# EAGLE design rhex (EAGLE 7.5.0)
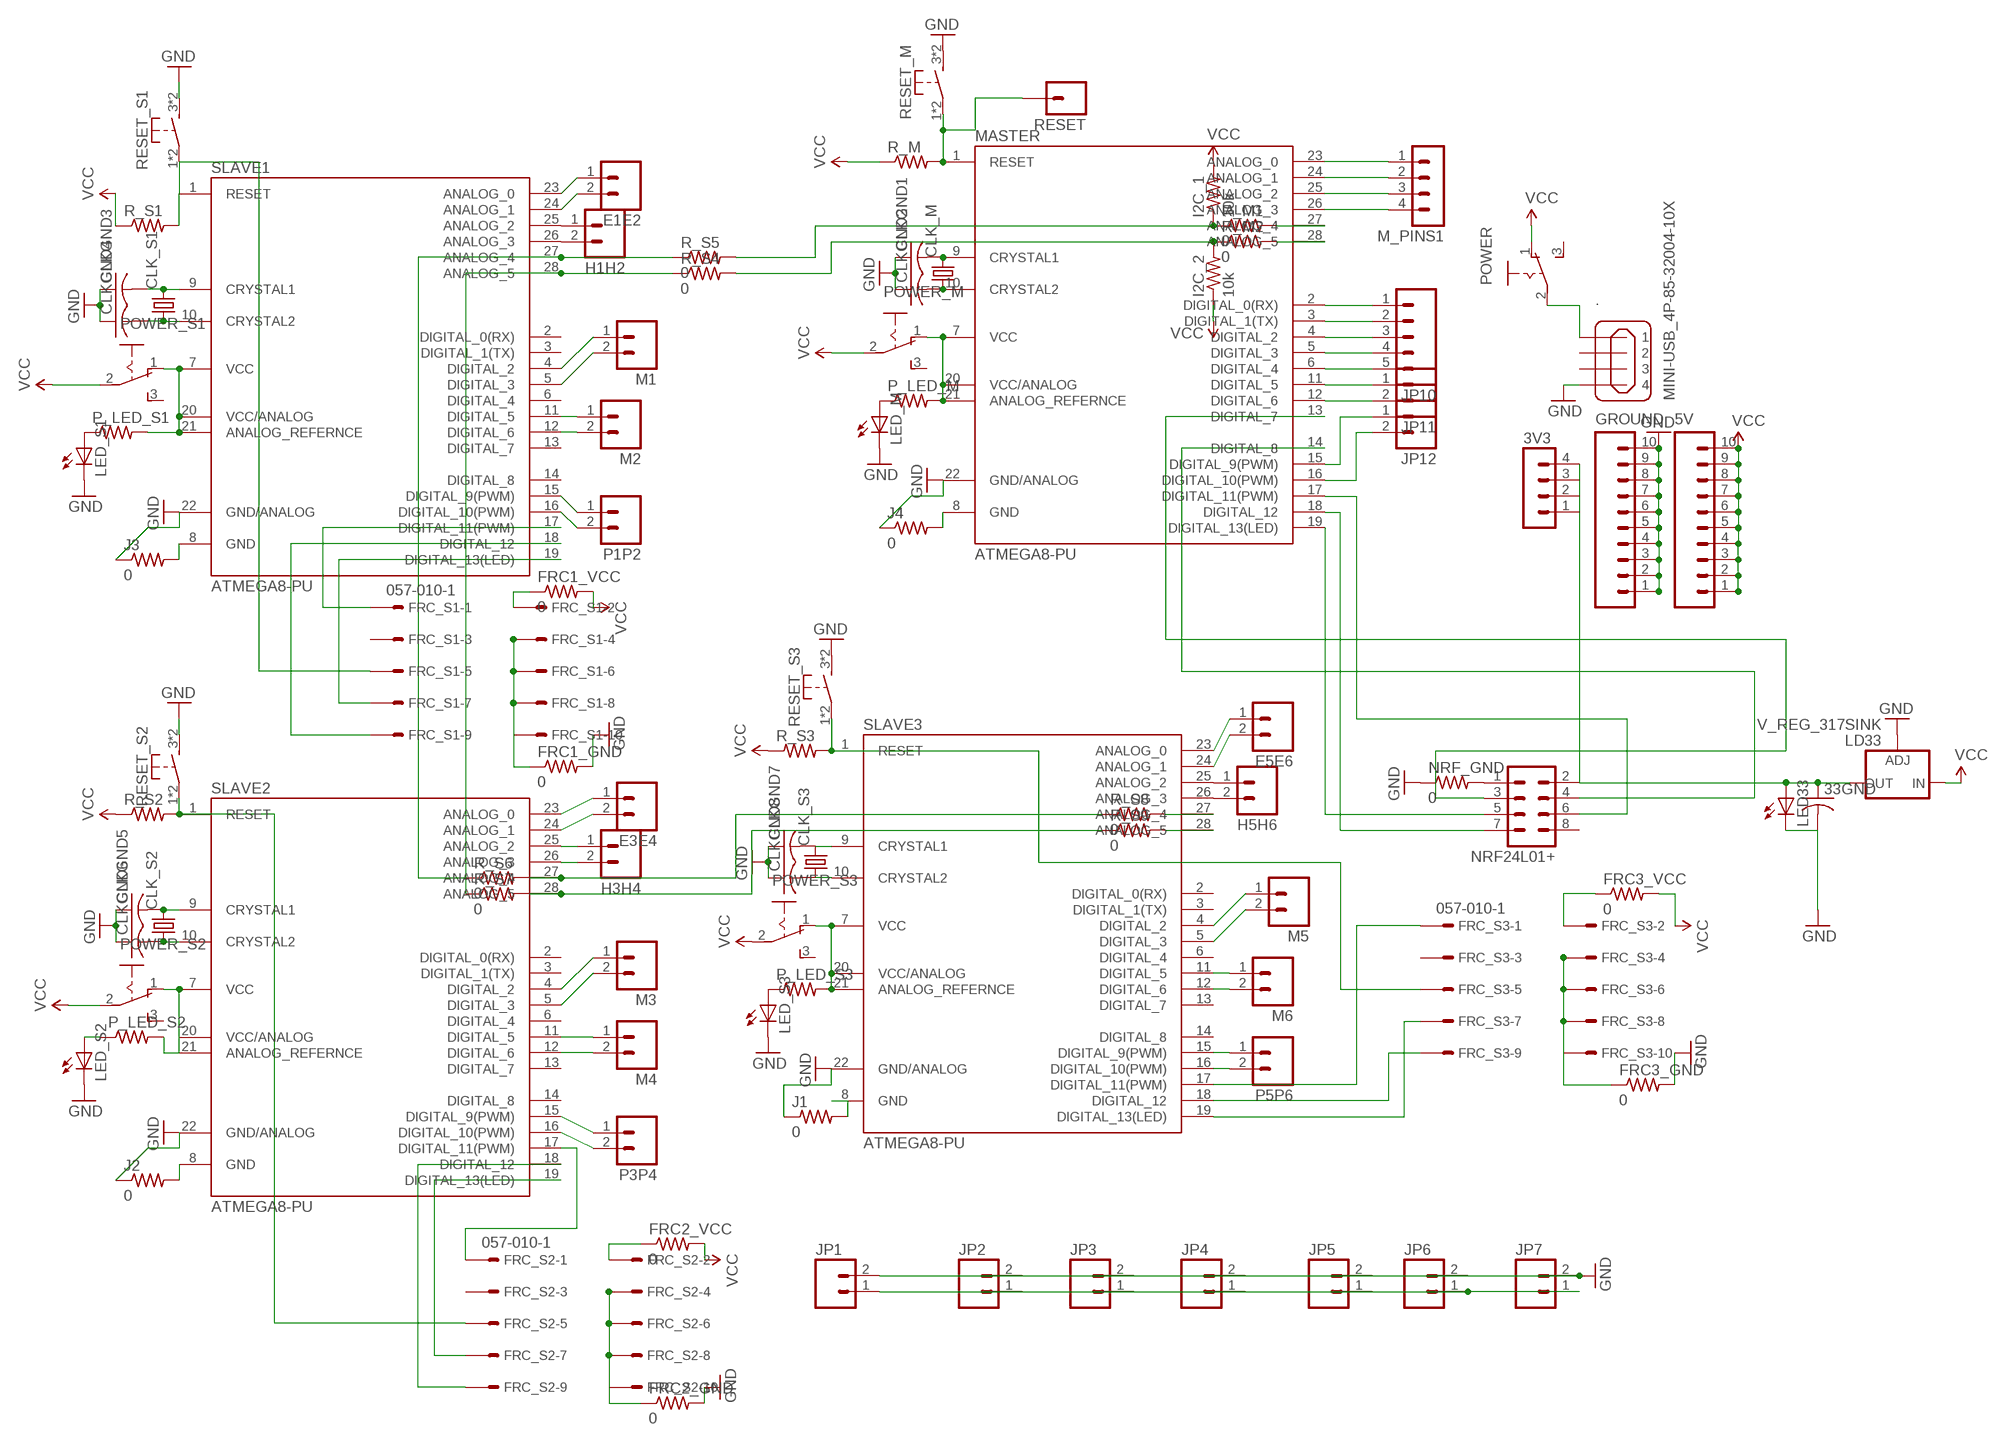
[diagram p0: schematic, sheet 1]

## Parts
3V3  MA04-1  [MA04-1]
5V  M10SILK_FEMALE_PTH  [1X10]
33GND  C-US050-024X044  [C050-024X044]
.  MINI-USB_4P-85-32004-10X  [85-32004-10X]
CLK_M  CRYSTALHC49U-V  [HC49U-V]
CLK_S1  CRYSTALHC49U-V  [HC49U-V]
CLK_S2  CRYSTALHC49U-V  [HC49U-V]
CLK_S3  CRYSTALHC49U-V  [HC49U-V]
CLKGND1  C-US050-024X044  [C050-024X044]
CLKGND2  C-US050-024X044  [C050-024X044]
CLKGND3  C-US050-024X044  [C050-024X044]
CLKGND4  C-US050-024X044  [C050-024X044]
CLKGND5  C-US050-024X044  [C050-024X044]
CLKGND6  C-US050-024X044  [C050-024X044]
CLKGND7  C-US050-024X044  [C050-024X044]
CLKGND8  C-US050-024X044  [C050-024X044]
E1E2  M02LOCK  [1X02_LOCK]
E3E4  M02LOCK  [1X02_LOCK]
E5E6  M02LOCK  [1X02_LOCK]
FRC1_GND  0  R-US_0411/15  [0411/15]
FRC1_VCC  0  R-US_0411/15  [0411/15]
FRC2_GND  0  R-US_0411/15  [0411/15]
FRC2_VCC  0  R-US_0411/15  [0411/15]
FRC3_GND  0  R-US_0411/15  [0411/15]
FRC3_VCC  0  R-US_0411/15  [0411/15]
FRC_S1  057-010-1  [057-010-1]
FRC_S2  057-010-1  [057-010-1]
FRC_S3  057-010-1  [057-010-1]
GROUND  M10SILK_FEMALE_PTH  [1X10]
H1H2  M02LOCK  [1X02_LOCK]
H3H4  M02LOCK  [1X02_LOCK]
H5H6  M02LOCK  [1X02_LOCK]
I2C_1  10k  R-US_0411/15  [0411/15]
I2C_2  10k  R-US_0411/15  [0411/15]
J1  0  R-US_0411/15  [0411/15]
J2  0  R-US_0411/15  [0411/15]
J3  0  R-US_0411/15  [0411/15]
J4  0  R-US_0411/15  [0411/15]
JP1  M023.5MM  [SCREWTERMINAL-3.5MM-2]
JP2  M023.5MM  [SCREWTERMINAL-3.5MM-2]
JP3  M023.5MM  [SCREWTERMINAL-3.5MM-2]
JP4  M023.5MM  [SCREWTERMINAL-3.5MM-2]
JP5  M023.5MM  [SCREWTERMINAL-3.5MM-2]
JP6  M023.5MM  [SCREWTERMINAL-3.5MM-2]
JP7  M023.5MM  [SCREWTERMINAL-3.5MM-2]
JP10  M05PTH  [1X05]
JP11  M02PTH  [1X02]
JP12  M02PTH  [1X02]
LD33  V_REG_317SINK  [TO220-ADJ]
LED33  LED3MM  [LED3MM]
LED_M  LED3MM  [LED3MM]
LED_S1  LED3MM  [LED3MM]
LED_S2  LED3MM  [LED3MM]
LED_S3  LED3MM  [LED3MM]
M1  M02LOCK  [1X02_LOCK]
M2  M02LOCK  [1X02_LOCK]
M3  M02LOCK  [1X02_LOCK]
M4  M02LOCK  [1X02_LOCK]
M5  M02LOCK  [1X02_LOCK]
M6  M02LOCK  [1X02_LOCK]
M_PINS1  MA04-1  [MA04-1]
MASTER  ATMEGA8-PU  [DIL28-3]
NRF24L01+  MA04-2  [MA04-2]
NRF_GND  0  R-US_0411/15  [0411/15]
P1P2  M02LOCK  [1X02_LOCK]
P3P4  M02LOCK  [1X02_LOCK]
P5P6  M02LOCK  [1X02_LOCK]
P_LED_M  R-US_0411/15  [0411/15]
P_LED_S1  R-US_0411/15  [0411/15]
P_LED_S2  R-US_0411/15  [0411/15]
P_LED_S3  R-US_0411/15  [0411/15]
POWER  M251  [M251]
POWER_M  M251  [M251]
POWER_S1  M251  [M251]
POWER_S2  M251  [M251]
POWER_S3  M251  [M251]
R_M  R-US_0411/15  [0411/15]
R_M1  0  R-US_0411/15  [0411/15]
R_M2  0  R-US_0411/15  [0411/15]
R_S1  R-US_0411/15  [0411/15]
R_S2  R-US_0411/15  [0411/15]
R_S3  R-US_0411/15  [0411/15]
R_S4  0  R-US_0411/15  [0411/15]
R_S5  0  R-US_0411/15  [0411/15]
R_S6  0  R-US_0411/15  [0411/15]
R_S7  0  R-US_0411/15  [0411/15]
R_S8  0  R-US_0411/15  [0411/15]
R_S9  0  R-US_0411/15  [0411/15]
RESET  M01PTH  [1X01]
RESET_M  SW-TACTILE-6X6  [SW6X6]
RESET_S1  SW-TACTILE-6X6  [SW6X6]
RESET_S2  SW-TACTILE-6X6  [SW6X6]
RESET_S3  SW-TACTILE-6X6  [SW6X6]
SLAVE1  ATMEGA8-PU  [DIL28-3]
SLAVE2  ATMEGA8-PU  [DIL28-3]
SLAVE3  ATMEGA8-PU  [DIL28-3]

## Nets
3V3: 3V3.1 3V3.4 33GND.1 LD33.OUT LED33.A NRF24L01+.2
12V: JP1.1 JP2.1 JP3.1 JP4.1 JP5.1 JP6.1 JP7.1
GND: 33GND.2 ..4 CLKGND1.1 CLKGND2.1 CLKGND3.1 CLKGND4.1 CLKGND5.1 CLKGND6.1 CLKGND7.1 CLKGND8.1 FRC1_GND.2 FRC2_GND.2 FRC3_GND.2 GROUND.1 GROUND.2 GROUND.3 GROUND.4 GROUND.5 GROUND.6 GROUND.7 GROUND.8 GROUND.9 GROUND.10 J1.1 J2.1 J3.1 J4.1 JP1.2 JP2.2 JP3.2 JP4.2 JP5.2 JP6.2 JP7.2 LD33.ADJ LED33.K(C) LED_M.K(C) LED_S1.K(C) LED_S2.K(C) LED_S3.K(C) MASTER.22(GND/ANALOG) NRF_GND.1 RESET_M.3(S1) RESET_M.4(S1) RESET_S1.3(S1) RESET_S1.4(S1) RESET_S2.3(S1) RESET_S2.4(S1) RESET_S3.3(S1) RESET_S3.4(S1) SLAVE1.22(GND/ANALOG) SLAVE2.22(GND/ANALOG) SLAVE3.22(GND/ANALOG)
N$1: CLK_M.2 CLKGND1.2 MASTER.9(CRYSTAL1)
N$2: CLK_M.1 CLKGND2.2 MASTER.10(CRYSTAL2)
N$3: MASTER.1(RESET) R_M.2 RESET.1 RESET_M.1 RESET_M.2(P1)
N$4: FRC_S2.1 SLAVE2.17(DIGITAL_11(PWM))
N$5: FRC_S3.5 R_S3.2 RESET_S3.1 RESET_S3.2(P1) SLAVE3.1(RESET)
N$6: FRC_S2.5 R_S2.2 RESET_S2.1 RESET_S2.2(P1) SLAVE2.1(RESET)
N$7: M3.1 SLAVE2.4(DIGITAL_2)
N$8: MASTER.19(DIGITAL_13(LED)) NRF24L01+.5
N$9: MASTER.18(DIGITAL_12) NRF24L01+.7
N$10: MASTER.17(DIGITAL_11(PWM)) NRF24L01+.6
N$11: R_S5.1 R_S6.1 SLAVE1.27(ANALOG_4)
N$12: R_S4.1 R_S7.1 SLAVE1.28(ANALOG_5)
N$13: M1.1 SLAVE1.4(DIGITAL_2)
N$14: M1.2 SLAVE1.5(DIGITAL_3)
N$15: M3.2 SLAVE2.5(DIGITAL_3)
N$16: M5.1 SLAVE3.4(DIGITAL_2)
N$17: M2.1 SLAVE1.11(DIGITAL_5)
N$18: MASTER.13(DIGITAL_7) NRF24L01+.3
N$19: M5.2 SLAVE3.5(DIGITAL_3)
N$20: M4.1 SLAVE2.11(DIGITAL_5)
N$21: M4.2 SLAVE2.12(DIGITAL_6)
N$22: M6.1 SLAVE3.11(DIGITAL_5)
N$23: M6.2 SLAVE3.12(DIGITAL_6)
N$24: M2.2 SLAVE1.12(DIGITAL_6)
N$25: JP10.1 MASTER.2(DIGITAL_0(RX))
N$26: I2C_2.2 R_M2.1 R_S4.2
N$27: NRF24L01+.1 NRF_GND.2
N$28: FRC_S2.7 SLAVE2.19(DIGITAL_13(LED))
N$29: E1E2.1 SLAVE1.23(ANALOG_0)
N$30: E1E2.2 SLAVE1.24(ANALOG_1)
N$31: E3E4.1 SLAVE2.23(ANALOG_0)
N$32: E3E4.2 SLAVE2.24(ANALOG_1)
N$33: E5E6.1 SLAVE3.23(ANALOG_0)
N$34: E5E6.2 SLAVE3.24(ANALOG_1)
N$35: CLK_S1.2 CLKGND3.2 SLAVE1.9(CRYSTAL1)
N$36: CLK_S1.1 CLKGND4.2 SLAVE1.10(CRYSTAL2)
N$37: CLK_S2.2 CLKGND5.2 SLAVE2.9(CRYSTAL1)
N$38: P3P4.1 SLAVE2.15(DIGITAL_9(PWM))
N$39: P3P4.2 SLAVE2.16(DIGITAL_10(PWM))
N$40: CLK_S2.1 CLKGND6.2 SLAVE2.10(CRYSTAL2)
N$41: CLK_S3.2 CLKGND7.2 SLAVE3.9(CRYSTAL1)
N$42: CLK_S3.1 CLKGND8.2 SLAVE3.10(CRYSTAL2)
N$43: FRC_S2.9 SLAVE2.18(DIGITAL_12)
N$44: ..1 POWER.2(P)
N$45: FRC_S3.1 SLAVE3.17(DIGITAL_11(PWM))
N$46: P_LED_S1.2 POWER_S1.1(O) SLAVE1.7(VCC) SLAVE1.20(VCC/ANALOG) SLAVE1.21(ANALOG_REFERNCE)
N$47: FRC_S3.7 SLAVE3.19(DIGITAL_13(LED))
N$48: FRC_S3.9 SLAVE3.18(DIGITAL_12)
N$49: FRC_S1.7 SLAVE1.19(DIGITAL_13(LED))
N$50: FRC_S1.9 SLAVE1.18(DIGITAL_12)
N$51: FRC_S1.1 SLAVE1.17(DIGITAL_11(PWM))
N$52: P1P2.1 SLAVE1.15(DIGITAL_9(PWM))
N$53: P_LED_S2.2 POWER_S2.1(O) SLAVE2.7(VCC) SLAVE2.20(VCC/ANALOG) SLAVE2.21(ANALOG_REFERNCE)
N$54: MASTER.7(VCC) MASTER.20(VCC/ANALOG) MASTER.21(ANALOG_REFERNCE) P_LED_M.2 POWER_M.1(O)
N$55: P_LED_S3.2 POWER_S3.1(O) SLAVE3.7(VCC) SLAVE3.20(VCC/ANALOG) SLAVE3.21(ANALOG_REFERNCE)
N$56: P1P2.2 SLAVE1.16(DIGITAL_10(PWM))
N$57: P5P6.1 SLAVE3.15(DIGITAL_9(PWM))
N$58: P5P6.2 SLAVE3.16(DIGITAL_10(PWM))
N$59: H5H6.1 SLAVE3.25(ANALOG_2)
N$60: H5H6.2 SLAVE3.26(ANALOG_3)
N$61: H1H2.1 SLAVE1.25(ANALOG_2)
N$62: H1H2.2 SLAVE1.26(ANALOG_3)
N$63: H3H4.1 SLAVE2.25(ANALOG_2)
N$64: H3H4.2 SLAVE2.26(ANALOG_3)
N$65: LED_S1.A P_LED_S1.1
N$66: LED_M.A P_LED_M.1
N$67: LED_S3.A P_LED_S3.1
N$68: FRC2_GND.1 FRC_S2.4 FRC_S2.6 FRC_S2.8 FRC_S2.10
N$69: LED_S2.A P_LED_S2.1
N$70: JP10.2 MASTER.3(DIGITAL_1(TX))
N$71: JP10.3 MASTER.4(DIGITAL_2)
N$72: JP10.4 MASTER.5(DIGITAL_3)
N$73: JP10.5 MASTER.6(DIGITAL_4)
N$74: JP11.1 MASTER.11(DIGITAL_5)
N$75: JP11.2 MASTER.12(DIGITAL_6)
N$76: JP12.1 MASTER.15(DIGITAL_9(PWM))
N$77: JP12.2 MASTER.16(DIGITAL_10(PWM))
N$78: MASTER.14(DIGITAL_8) NRF24L01+.4
N$79: M_PINS1.1 MASTER.23(ANALOG_0)
N$80: M_PINS1.2 MASTER.24(ANALOG_1)
N$81: M_PINS1.3 MASTER.25(ANALOG_2)
N$82: M_PINS1.4 MASTER.26(ANALOG_3)
N$83: J1.2 SLAVE3.8(GND)
N$84: J2.2 SLAVE2.8(GND)
N$85: J3.2 SLAVE1.8(GND)
N$86: J4.2 MASTER.8(GND)
N$87: FRC1_GND.1 FRC_S1.4 FRC_S1.6 FRC_S1.8 FRC_S1.10
N$88: FRC_S1.5 R_S1.2 RESET_S1.1 RESET_S1.2(P1) SLAVE1.1(RESET)
N$89: FRC3_GND.1 FRC_S3.4 FRC_S3.6 FRC_S3.8 FRC_S3.10
N$90: FRC1_VCC.1 FRC_S1.2
N$91: FRC2_VCC.1 FRC_S2.2
N$92: FRC3_VCC.1 FRC_S3.2
N$93: I2C_1.1 R_M1.1 R_S5.2
N$94: R_S6.2 R_S8.1 SLAVE2.27(ANALOG_4)
N$95: R_S7.2 R_S9.1 SLAVE2.28(ANALOG_5)
N$96: R_S8.2 SLAVE3.27(ANALOG_4)
N$97: R_S9.2 SLAVE3.28(ANALOG_5)
N$98: MASTER.27(ANALOG_4) R_M1.2
N$99: MASTER.28(ANALOG_5) R_M2.2
VCC: 5V.1 5V.2 5V.3 5V.4 5V.5 5V.6 5V.7 5V.8 5V.9 5V.10 FRC1_VCC.2 FRC2_VCC.2 FRC3_VCC.2 I2C_1.2 I2C_2.1 LD33.IN POWER.1(O) POWER_M.2(P) POWER_S1.2(P) POWER_S2.2(P) POWER_S3.2(P) R_M.1 R_S1.1 R_S2.1 R_S3.1
Unconnected: 3V3.2 3V3.3 ..2 ..3 FRC_S1.3 FRC_S2.3 FRC_S3.3 NRF24L01+.8 POWER.3(S) POWER_M.3(S) POWER_S1.3(S) POWER_S2.3(S) POWER_S3.3(S) SLAVE1.2(DIGITAL_0(RX)) SLAVE1.3(DIGITAL_1(TX)) SLAVE1.6(DIGITAL_4) SLAVE1.13(DIGITAL_7) SLAVE1.14(DIGITAL_8) SLAVE2.2(DIGITAL_0(RX)) SLAVE2.3(DIGITAL_1(TX)) SLAVE2.6(DIGITAL_4) SLAVE2.13(DIGITAL_7) SLAVE2.14(DIGITAL_8) SLAVE3.2(DIGITAL_0(RX)) SLAVE3.3(DIGITAL_1(TX)) SLAVE3.6(DIGITAL_4) SLAVE3.13(DIGITAL_7) SLAVE3.14(DIGITAL_8)

## Library data of the parts
3V3 M_PINS1 = con-lstb:MA04-1: PIN HEADER; OC_FARNELL: unknown; OC_NEWARK: unknown
5V GROUND = SparkFun-Connectors:M10: Header 10 Standard 10-pin 0.1" header. Use with straight break away headers (SKU : PRT-00116), right angle break away headers (PRT-00553), swiss pins (PRT-00743), machine pins (PRT-00117), and female headers (PRT-00115).; PROD_ID: CONN-11563
33GND CLKGND1-CLKGND8 = rcl:C-US: CAPACITOR, American symbol
. = con-cypressindustries:MINI-USB_4P-: MINI USB 4 Pol. Source: www.cypressindustries.com; OC_FARNELL: unknown; OC_NEWARK: unknown
CLK_M CLK_S1-CLK_S3 = adafruit:CRYSTAL: CRYSTAL; OC_FARNELL: 1666969; OC_NEWARK: unknown
E1E2 E3E4 E5E6 H1H2 H3H4 H5H6 JP11 JP12 M1-M6 P1P2 P3P4 P5P6 = SparkFun-Connectors:M02: Standard 2-pin 0.1" header. Use with - straight break away headers ( PRT-00116) - right angle break away headers (PRT-00553) - swiss pins (PRT-00743) - machine pins (PRT-00117) - female headers (PRT-00115) Molex polarized connector foot print use with: PRT-08233 with associated crimp pins and housings. 2.54_SCREWTERM for use with PRT-10571. 3.5mm Screw Terminal footprints for PRT-08084 5mm Screw Terminal footprints for use with PRT-08432
FRC1_GND FRC1_VCC FRC2_GND FRC2_VCC FRC3_GND FRC3_VCC I2C_1 I2C_2 J1-J4 NRF_GND P_LED_M P_LED_S1-P_LED_S3 R_M R_M1 R_M2 R_S1-R_S9 = adafruit:R-US_: RESISTOR, American symbol
FRC_S1-FRC_S3 = con-panduit:057-010-: CONNECTOR 10-pin series 057 contact pc board low profile headers; OC_FARNELL: unknown; OC_NEWARK: unknown
JP1-JP7 = SparkFun-Connectors:M02: Standard 2-pin 0.1" header. Use with - straight break away headers ( PRT-00116) - right angle break away headers (PRT-00553) - swiss pins (PRT-00743) - machine pins (PRT-00117) - female headers (PRT-00115) Molex polarized connector foot print use with: PRT-08233 with associated crimp pins and housings. 2.54_SCREWTERM for use with PRT-10571. 3.5mm Screw Terminal footprints for PRT-08084 5mm Screw Terminal footprints for use with PRT-08432; PROD_ID: CONN-08399
JP10 = SparkFun-Connectors:M05: Header 5 Standard 5-pin 0.1" header. Use with straight break away headers (SKU : PRT-00116), right angle break away headers (PRT-00553), swiss pins (PRT-00743), machine pins (PRT-00117), and female headers (PRT-00115). Molex polarized connector foot print use with SKU : PRT-08230 with associated crimp pins and housings.
LD33 = SparkFun-PowerIC:V_REG_317: Voltage Regulator Standard LM317 adjustable voltage regulator. AOI (Adjust Output Input). Google 'LM317 Calculator' for easy to use app to get the two resistor values needed. 240/720 for 5V output. 240/390 for 3.3V output. Spark Fun Electronics SKU : COM-00527
LED33 = adafruit:LED: LED
LED_M LED_S1-LED_S3 = led:LED: LED
MASTER SLAVE1-SLAVE3 = Arduino-AVR:ATMEGA8-PU
NRF24L01+ = con-lstb:MA04-2: PIN HEADER; OC_FARNELL: unknown; OC_NEWARK: unknown
POWER POWER_M POWER_S1-POWER_S3 = switch:M251: SLIDING SWITCH Mors, distributor Buerklin, 11G702
RESET = SparkFun-Connectors:M01: Header 1 Standard 1-pin 0.1" header. Use with straight break away headers (SKU : PRT-00116), right angle break away headers (PRT-00553), swiss pins (PRT-00743), machine pins (PRT-00117), and female headers (PRT-00115). SMTSO-256-ET is a "flush mount" nut for a 4-40 screw. The older package used to be too tight, and did not allow it to sit properly thru the drill hit. The latest (0.165DIA) fits nice and snug.
RESET_M RESET_S1-RESET_S3 = we-switch:SW-TACTILE: Tactile Switches

## Board
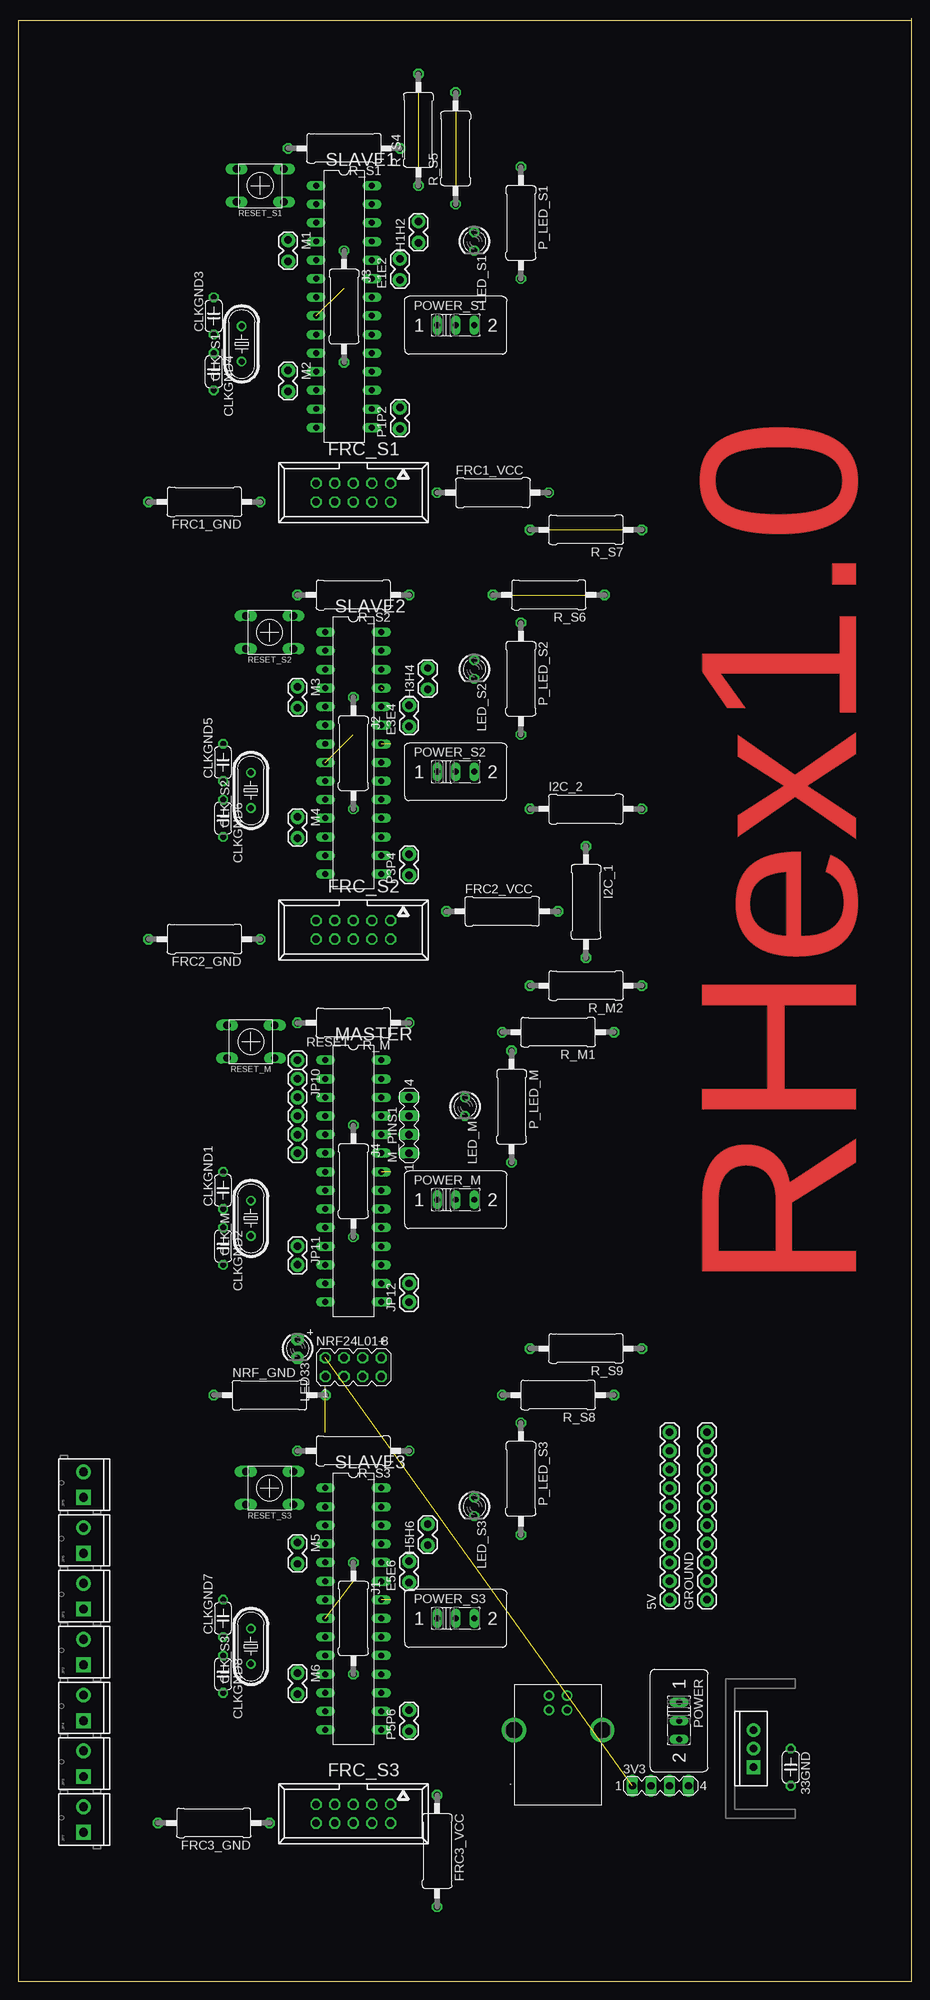
[diagram p1: board, top side]
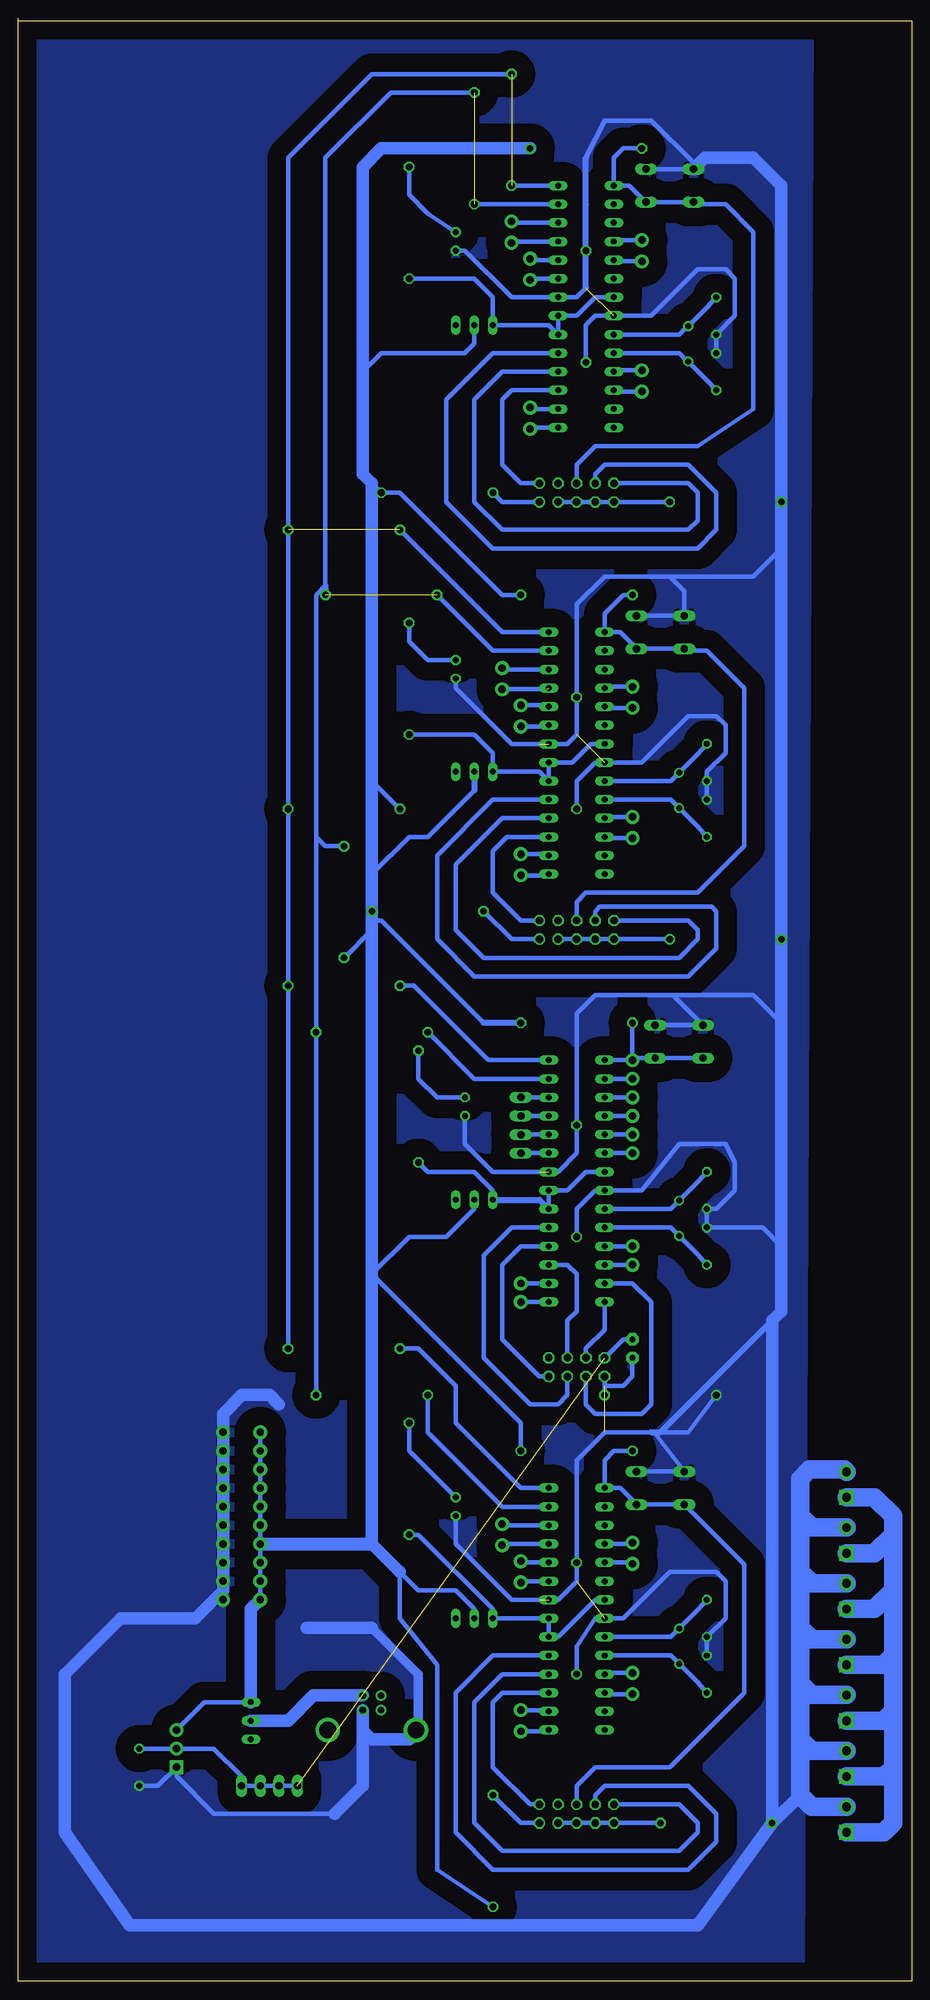
[diagram p2: board, bottom side, seen from below]

Size 121.92 x 267.95 mm. Coordinates in mm from the lower left corner, seen from the top.
Outline: 121.9,0 0,0 0,267.64 121.9,267.64
Outline: 121.92,0 121.92,267.95
Copper layers (1*16): Top 0.035mm / dielectric 1.5mm / Bottom 0.035mm
Design rules "default": minimum track width 10mil, minimum drill 24mil, track to track 8mil, track to pad 8mil, pad to pad 8mil, via to via 8mil, smd to smd 8mil, copper to edge 40mil, drill to drill 8mil, minimum pad ring 10mil, minimum via ring 8mil, stop-mask expansion 4mil, vias tented up to drill 0mil, thermal gap 10mil

### Footprints (pad centres in the part's own frame; a part is rotated, then mirrored left to right if it is on the bottom)
MA04-1 = drill 1.016 long: 1 -3.81,0; 2 -1.27,0; 3 1.27,0; 4 3.81,0
1X10 = drill 1.016 pad 1.88: 1 0,0; 2 2.54,0; 3 5.08,0; 4 7.62,0; 5 10.16,0; 6 12.7,0; 7 15.24,0; 8 17.78,0; 9 20.32,0; 10 22.86,0
C050-024X044 = drill 0.813 octagon: 1 -2.54,0; 2 2.54,0
85-32004-10X = drill 0.92 pad 1.27: 1 4.71,-1.25; 2 4.71,1.25; 3 2.71,1.25; 4 2.71,-1.25 | drill 2.3 pad 3: M1 0,6.02; M2 0,-6.02
HC49U-V = drill 0.813: 1 -2.413,0; 2 2.413,0
1X02_LOCK = drill 1.016 pad 1.88: 1 -0.178,0; 2 2.718,0
0411/15 = drill 0.914 octagon: 1 -7.62,0; 2 7.62,0
057-010-1 = drill 1 octagon: 1 -5.08,-1.27; 2 -5.08,1.27; 3 -2.54,-1.27; 4 -2.54,1.27; 5 0,-1.27; 6 0,1.27; 7 2.54,-1.27; 8 2.54,1.27; 9 5.08,-1.27; 10 5.08,1.27
SCREWTERMINAL-3.5MM-2 = drill 1.2 pad 2.032 square: 1 0,0 | drill 1.2 pad 2.032: 2 3.5,0
1X05 = drill 1.016 pad 1.88: 1 0,0; 2 2.54,0; 3 5.08,0; 4 7.62,0; 5 10.16,0
1X02 = drill 1.016 pad 1.88: 1 0,0; 2 2.54,0
TO220-ADJ = drill 1 pad 1.88 square: ADJ -2.54,0 | drill 1 pad 1.88: IN 2.54,0; OUT 0,0
LED3MM = drill 0.813 pad 1.676 octagon: A -1.27,0; K 1.27,0
LED3MM' = drill 0.813 octagon: A -1.27,0; K 1.27,0
DIL28-3 = drill 0.813 long: 1 -16.51,-3.81; 2 -13.97,-3.81; 3 -11.43,-3.81; 4 -8.89,-3.81; 5 -6.35,-3.81; 6 -3.81,-3.81; 7 -1.27,-3.81; 8 1.27,-3.81; 9 3.81,-3.81; 10 6.35,-3.81; 11 8.89,-3.81; 12 11.43,-3.81; 13 13.97,-3.81; 14 16.51,-3.81; 15 16.51,3.81; 16 13.97,3.81; 17 11.43,3.81; 18 8.89,3.81; 19 6.35,3.81; 20 3.81,3.81; 21 1.27,3.81; 22 -1.27,3.81; 23 -3.81,3.81; 24 -6.35,3.81; 25 -8.89,3.81; 26 -11.43,3.81; 27 -13.97,3.81; 28 -16.51,3.81
MA04-2 = drill 1.016 octagon: 1 -3.81,-1.27; 2 -3.81,1.27; 3 -1.27,-1.27; 4 -1.27,1.27; 5 1.27,-1.27; 6 1.27,1.27; 7 3.81,-1.27; 8 3.81,1.27
M251 = drill 0.813 long: 1 -2.54,0; 2 0,0; 3 2.54,0
1X01 = drill 1.016 pad 1.88: 1 0,0
SW6X6 = drill 1 long: 1 -3.25,2.25; 2 3.25,2.25 | drill 1.016 long: 3 -3.25,-2.25; 4 3.25,-2.25

### Placement (x,y rotation side)
3V3  87.63,26.67 0 top
5V  88.9,52.07 90 top
33GND  105.41,29.21 270 top
.  73.66,34.29 90 top
CLK_M  31.75,104.14 90 top
CLK_S1  30.48,223.52 90 top
CLK_S2  31.75,162.56 90 top
CLK_S3  31.75,45.72 90 top
CLKGND1  27.94,107.95 90 top
CLKGND2  27.94,100.33 270 top
CLKGND3  26.67,227.33 90 top
CLKGND4  26.67,219.71 270 top
CLKGND5  27.94,166.37 90 top
CLKGND6  27.94,158.75 270 top
CLKGND7  27.94,49.53 90 top
CLKGND8  27.94,41.91 270 top
E1E2  52.07,232.41 90 top
E3E4  53.34,171.45 90 top
E5E6  53.34,54.61 90 top
FRC1_GND  25.4,201.93 180 top
FRC1_VCC  64.77,203.2 0 top
FRC2_GND  25.4,142.24 180 top
FRC2_VCC  66.04,146.05 0 top
FRC3_GND  26.67,21.59 180 top
FRC3_VCC  57.15,17.78 270 top
FRC_S1  45.72,203.2 180 top
FRC_S2  45.72,143.51 180 top
FRC_S3  45.72,22.86 180 top
GROUND  93.98,52.07 90 top
H1H2  54.61,237.49 90 top
H3H4  55.88,176.53 90 top
H5H6  55.88,59.69 90 top
I2C_1  77.47,147.32 270 top
I2C_2  77.47,160.02 0 top
J1  45.72,49.53 270 top
J2  45.72,167.64 270 top
J3  44.45,228.6 270 top
J4  45.72,109.22 270 top
JP1  8.89,50.8 90 top
JP2  8.89,43.18 90 top
JP3  8.89,27.94 90 top
JP4  8.89,35.56 90 top
JP5  8.89,66.04 90 top
JP6  8.89,58.42 90 top
JP7  8.89,20.32 90 top
JP10  38.1,123.19 270 top
JP11  38.1,100.33 270 top
JP12  53.34,92.71 90 top
LD33  100.33,31.75 90 top
LED33  38.1,86.36 270 top
LED_M  [LED3MM']  60.96,119.38 270 top
LED_S1  [LED3MM']  62.23,237.49 270 top
LED_S2  [LED3MM']  62.23,179.07 270 top
LED_S3  [LED3MM']  62.23,64.77 270 top
M1  36.83,237.49 270 top
M2  36.83,219.71 270 top
M3  38.1,176.53 270 top
M4  38.1,158.75 270 top
M5  38.1,59.69 270 top
M6  38.1,41.91 270 top
M_PINS1  53.34,116.84 90 top
MASTER  45.72,109.22 270 top
NRF24L01+  45.72,83.82 0 top
NRF_GND  34.29,80.01 0 top
P1P2  52.07,212.09 90 top
P3P4  53.34,151.13 90 top
P5P6  53.34,34.29 90 top
P_LED_M  67.31,119.38 270 top
P_LED_S1  68.58,240.03 270 top
P_LED_S2  68.58,177.8 270 top
P_LED_S3  68.58,68.58 270 top
POWER  90.17,35.56 270 top
POWER_M  59.69,106.68 0 top
POWER_S1  59.69,226.06 0 top
POWER_S2  59.69,165.1 0 top
POWER_S3  59.69,49.53 0 top
R_M  45.72,130.81 180 top
R_M1  73.66,129.54 180 top
R_M2  77.47,135.89 180 top
R_S1  44.45,250.19 180 top
R_S2  45.72,189.23 180 top
R_S3  45.72,72.39 180 top
R_S4  54.61,252.73 90 top
R_S5  59.69,250.19 90 top
R_S6  72.39,189.23 180 top
R_S7  77.47,198.12 180 top
R_S8  73.66,80.01 180 top
R_S9  77.47,86.36 180 top
RESET  38.1,125.73 0 top
RESET_M  31.75,128.27 180 top
RESET_S1  33.02,245.11 180 top
RESET_S2  34.29,184.15 180 top
RESET_S3  34.29,67.31 180 top
SLAVE1  44.45,228.6 270 top
SLAVE2  45.72,167.64 270 top
SLAVE3  45.72,50.8 270 top

### Tracks (layer width: path | path; a pad name or v marks a point on that pad's centre or on a via)
3V3  (1 unrouted)
  Bottom 0.61: 3V3.1 3V3.4 91.44,27.94 95.25,31.75 LD33.OUT 33GND.1 | LED33.A 39.37,87.63 NRF24L01+.2
12V
  Bottom 2.54: JP3.1 3.81,27.94 2.54,29.21 | 2.54,29.21 2.54,36.83 | 2.54,36.83 2.54,44.45 | 2.54,44.45 2.54,53.34 | 2.54,53.34 2.54,60.96 | 2.54,60.96 2.54,63.5 5.08,66.04 JP5.1 | JP6.1 5.08,58.42 2.54,60.96 | JP1.1 5.08,50.8 2.54,53.34 | JP2.1 3.81,43.18 2.54,44.45 | JP4.1 3.81,35.56 2.54,36.83 | JP7.1 3.81,20.32 2.54,21.59 2.54,29.21
GND  (7 unrouted)
  Bottom 0.406: 44.45,245.11 44.45,242.57
  Bottom 0.61: CLKGND8.1 CLKGND7.1 25.4,49.53 25.4,54.61 26.67,55.88 33.02,55.88 39.37,49.53 41.91,49.53 | CLKGND6.1 CLKGND5.1 27.94,165.1 25.4,167.64 25.4,171.45 26.67,172.72 30.48,172.72 36.83,166.37 41.91,166.37 | CLKGND4.1 CLKGND3.1 24.13,227.33 24.13,232.41 25.4,233.68 29.21,233.68 35.56,227.33 40.64,227.33 | SLAVE2.22 46.99,168.91 45.72,170.18 J2.1 45.72,187.96 41.91,191.77 33.02,191.77 | MASTER.22 48.26,110.49 45.72,113.03 J4.1 45.72,132.08 43.18,134.62 32.6,134.62 | SLAVE3.22 48.26,52.07 45.72,54.61 J1.1 45.72,71.12 41.91,74.93 35.14,74.93 | 41.91,107.95 36.83,107.95 31.75,114.3 25.4,114.3 24.13,111.76 24.13,107.95 26.67,105.41 CLKGND1.1 CLKGND2.1 20.32,102.87 17.78,100.33 | RESET_S3.3 RESET_S3.4 35.14,74.93 | RESET_S1.3 RESET_S1.4 29.77,248.21 35.56,254 41.91,254 44.45,248.92 | 44.45,242.57 J3.1 44.45,231.14 45.72,229.87 SLAVE1.22 54.61,229.87 60.96,236.22 LED_S1.K | 32.6,134.62 RESET_M.4 RESET_M.3 | RESET_S2.3 RESET_S2.4 31.04,189.79 33.02,191.77 | GROUND.1 GROUND.2 GROUND.3 GROUND.4 GROUND.5 GROUND.6 GROUND.7 GROUND.8 GROUND.9 GROUND.10 | 33GND.2 102.87,26.67 LD33.ADJ 100.33,27.94 95.25,22.86 78.74,22.86 | 32.6,134.62 21.59,134.62 17.78,130.81 | LED33.K 38.1,82.55 39.37,81.28 41.91,81.28 | 33.02,191.77 21.59,191.77 17.78,195.58 | 74.93,36.98 ..4 | NRF_GND.1 30.48,74.93 35.14,74.93 | LED_S2.K 62.23,176.53 54.61,168.91 50.8,168.91 | LED_M.K 60.96,114.3 57.15,110.49 50.8,110.49 | LED_S3.K 62.23,59.69 54.61,52.07 50.8,52.07
  Bottom 0.813: 35.56,74.93 35.14,74.93 34.29,74.93 17.78,91.44 | 44.45,231.14 44.45,242.57 44.45,248.92
  Bottom 1.27: 68.58,33.02 67.31,34.29 67.31,41.91 73.66,48.26
  Bottom 1.676: ..4 74.91,34.27 73.66,33.02 68.58,33.02 | RESET_S1.4 28.21,248.92 21.59,248.92 17.78,245.11 FRC1_GND.2 17.78,195.58 FRC2_GND.2 17.78,130.81 17.78,100.33 17.78,91.44 19.05,90.17 FRC3_GND.2 | 78.74,22.86 74.93,26.67 74.93,36.98 | FRC3_GND.2 15.24,25.4 | 82.55,48.26 73.66,48.26 | FRC3_GND.2 29.21,7.62 106.68,7.62 115.57,20.32 115.57,41.91 107.95,49.53 97.79,49.53 93.98,53.34 93.98,77.47 91.44,80.01 87.63,80.01 86.36,78.74
  Bottom 2.54: JP7.2 13.66,23.82 15.24,25.4 15.24,33.02 | 15.24,33.02 15.24,40.64 | 15.24,40.64 15.24,48.26 | 15.24,48.26 15.24,55.88 | 15.24,55.88 15.24,63.5 | 15.24,63.5 15.24,68.58 13.97,69.85 9.2,69.85 JP5.2 | JP6.2 13.66,61.92 15.24,63.5 | JP1.2 13.66,54.3 15.24,55.88 | JP2.2 13.66,46.68 15.24,48.26 | JP4.2 13.66,39.06 15.24,40.64 | JP3.2 13.66,31.44 15.24,33.02
  pour Bottom (isolate 2.54): 15.24,1.27 13.97,267.97 121.92,267.97 121.92,1.27
N$1
  Bottom 0.61: MASTER.9 32.89,105.41 CLK_M.2 29.21,109.09 CLKGND1.2
N$2
  Bottom 0.61: MASTER.10 32.89,102.87 CLK_M.1 29.21,99.19 CLKGND2.2
N$3
  Bottom 0.61: RESET.1 MASTER.1 | RESET_M.2 RESET_M.1 37.81,126.02 RESET.1 | R_M.2 RESET.1
N$4
  Bottom 0.61: FRC_S2.1 53.34,144.78 57.15,148.59 57.15,154.31 55.24,156.21 SLAVE2.17
N$5
  Bottom 0.61: R_S3.2 40.64,72.39 41.91,71.12 SLAVE3.1 39.79,67.31 RESET_S3.1 RESET_S3.2 22.86,56.88 22.86,39.37 33.02,29.21 43.18,29.21 45.72,26.67 FRC_S3.5
N$6
  Bottom 0.61: R_S2.2 39.37,189.23 41.91,186.69 SLAVE2.1 39.79,184.15 RESET_S2.1 RESET_S2.2 30.75,181.61 27.94,181.61 22.86,176.53 22.86,154.94 29.21,148.59 44.45,148.59 45.72,147.32 FRC_S2.5
N$7
  Bottom 0.61: M3.1 41.73,176.71 SLAVE2.4
N$8
  Bottom 0.61: MASTER.19 54.61,102.87 58.42,99.06 58.42,85.09 52.07,78.74 48.26,78.74 46.99,80.01 NRF24L01+.5
N$9
  Bottom 0.61: NRF24L01+.7 50.8,82.55 55.88,87.63 55.88,97.79 53.34,100.33 MASTER.18
N$10
  Bottom 0.61: NRF24L01+.6 46.99,90.17 45.72,91.44 45.72,96.52 46.99,97.79 MASTER.17
N$11  (1 unrouted)
  Bottom 0.61: R_S5.1 SLAVE1.27 | R_S6.1 80.01,248.92 71.12,257.81 59.69,257.81
N$12  (1 unrouted)
  Bottom 0.61: SLAVE1.28 R_S4.1 | 85.09,135.89 R_S7.1 85.09,248.92 73.66,260.35 54.61,260.35
N$13
  Bottom 0.406: 40.46,237.67 SLAVE1.4
  Bottom 0.61: M1.1 40.46,237.67
N$14
  Bottom 0.406: 40.46,234.77 SLAVE1.5
  Bottom 0.61: M1.2 40.46,234.77
N$15
  Bottom 0.61: M3.2 41.73,173.81 SLAVE2.5
N$16
  Bottom 0.406: 38.28,59.69 M5.1
  Bottom 0.61: SLAVE3.4 38.28,59.69
N$17
  Bottom 0.406: 40.46,219.89 SLAVE1.11
  Bottom 0.61: M2.1 40.46,219.89
N$18
  Bottom 0.61: MASTER.13 38.1,95.25 35.56,92.71 35.56,78.74 36.83,77.47 43.18,77.47 44.45,78.74 NRF24L01+.3
N$19
  Bottom 0.406: 38.28,57.15 M5.2
  Bottom 0.61: SLAVE3.5 38.28,57.15
N$20
  Bottom 0.61: M4.1 41.73,158.93 SLAVE2.11
N$21
  Bottom 0.61: M4.2 41.73,156.03 SLAVE2.12
N$22
  Bottom 0.406: 41.73,42.09 SLAVE3.11
  Bottom 0.61: M6.1 41.73,42.09
N$23
  Bottom 0.406: 41.73,39.19 SLAVE3.12
  Bottom 0.61: M6.2 41.73,39.19
N$24
  Bottom 0.406: 40.46,216.99 SLAVE1.12
  Bottom 0.61: M2.2 40.46,216.99
N$25
  Bottom 0.61: JP10.1 MASTER.2
N$26
  Bottom 0.61: R_S4.2 73.66,260.35 85.09,248.92 I2C_2.2 R_M2.1
N$27
  Bottom 0.61: NRF24L01+.1 NRF_GND.2
N$28
  Bottom 0.61: SLAVE2.19 57.15,161.29 64.77,153.67 64.77,142.24 59.69,137.16 30.48,137.16 26.67,140.97 26.67,146.05 27.3,146.69 42.54,146.69 43.18,146.05 FRC_S2.7
N$29
  Bottom 0.406: 51.89,232.41 E1E2.1
  Bottom 0.61: SLAVE1.23 51.89,232.41
N$30
  Bottom 0.406: 51.89,234.95 E1E2.2
  Bottom 0.61: SLAVE1.24 51.89,234.95
N$31
  Bottom 0.406: 49.71,171.27 SLAVE2.23
  Bottom 0.61: E3E4.1 49.71,171.27
N$32
  Bottom 0.406: 49.71,174.17 SLAVE2.24
  Bottom 0.61: E3E4.2 49.71,174.17
N$33
  Bottom 0.406: 53.16,54.61 E5E6.1
  Bottom 0.61: SLAVE3.23 53.16,54.61
N$34
  Bottom 0.406: 53.16,57.15 E5E6.2
  Bottom 0.61: SLAVE3.24 53.16,57.15
N$35
  Bottom 0.406: CLK_S1.2 30.48,226.06
  Bottom 0.61: CLKGND3.2 27.94,228.47 CLK_S1.2 | 30.48,226.06 31.75,224.79 SLAVE1.9
N$36
  Bottom 0.406: CLK_S1.1 30.61,221.11
  Bottom 0.61: CLKGND4.2 27.94,218.57 CLK_S1.1 | 30.61,221.11 31.75,222.25 SLAVE1.10
N$37
  Bottom 0.61: SLAVE2.9 32.89,163.83 CLK_S2.2 29.21,167.51 CLKGND5.2
N$38
  Bottom 0.61: P3P4.1 49.71,150.95 SLAVE2.15
N$39
  Bottom 0.61: P3P4.2 49.71,153.85 SLAVE2.16
N$40
  Bottom 0.61: SLAVE2.10 32.89,161.29 CLK_S2.1 29.21,157.61 CLKGND6.2
N$41
  Bottom 0.61: SLAVE3.9 32.89,46.99 CLK_S3.2 29.21,50.67 CLKGND7.2
N$42
  Bottom 0.61: SLAVE3.10 32.89,44.45 CLK_S3.1 29.21,40.77 CLKGND8.2
N$43
  Bottom 0.61: SLAVE2.18 55.88,158.75 62.23,152.4 62.23,143.51 58.42,139.7 31.75,139.7 29.21,142.24 29.21,143.51 30.48,144.78 FRC_S2.9
N$44
  Bottom 1.676: ..1 81.65,39 85.09,35.56 POWER.2
N$45
  Bottom 0.61: FRC_S3.1 52.07,24.13 57.15,29.21 57.15,38.1 55.88,39.37 SLAVE3.17
N$46
  Bottom 0.61: SLAVE1.7 43.18,229.87 45.72,227.33 SLAVE1.21 SLAVE1.20 49.53,226.06 POWER_S1.1 57.15,229.87 59.69,232.41 P_LED_S1.2
N$47
  Bottom 0.61: FRC_S3.7 43.18,25.4 41.91,26.67 30.48,26.67 26.67,22.86 26.67,19.05 30.48,15.24 57.15,15.24 62.23,20.32 62.23,39.37 57.15,44.45 SLAVE3.19
N$48
  Bottom 0.61: FRC_S3.9 31.75,24.13 29.21,21.59 29.21,20.32 31.75,17.78 55.88,17.78 59.69,21.59 59.69,38.1 55.88,41.91 SLAVE3.18
N$49
  Bottom 0.61: SLAVE1.19 57.15,222.25 63.5,215.9 63.5,201.93 57.15,195.58 29.21,195.58 26.67,198.12 26.67,203.2 30.48,207.01 41.91,207.01 43.18,205.74 FRC_S1.7
N$50
  Bottom 0.61: SLAVE1.18 55.88,219.71 59.69,215.9 59.69,201.93 55.88,198.12 30.48,198.12 29.21,199.39 29.21,203.2 30.48,204.47 FRC_S1.9
N$51
  Bottom 0.61: SLAVE1.17 54.61,217.17 55.88,215.9 55.88,207.01 53.34,204.47 FRC_S1.1
N$52
  Bottom 0.406: 51.89,212.09 P1P2.1
  Bottom 0.61: SLAVE1.15 51.89,212.09
N$53
  Bottom 0.61: SLAVE2.7 43.82,168.91 46.35,166.37 SLAVE2.21 SLAVE2.20 50.8,165.1 POWER_S2.1 57.15,167.64 59.69,170.18 P_LED_S2.2
N$54
  Bottom 0.61: MASTER.7 44.45,110.49 46.99,107.95 MASTER.21 MASTER.20 | POWER_M.1 57.15,107.95 59.69,110.49 66.04,110.49 P_LED_M.2
  Bottom 0.813: POWER_M.1 50.8,106.68 MASTER.20
N$55
  Bottom 0.61: SLAVE3.7 43.18,52.07 48.26,46.99 SLAVE3.20 SLAVE3.21 POWER_S3.1 57.15,50.8 67.31,60.96 P_LED_S3.2
N$56
  Bottom 0.406: 51.89,214.63 P1P2.2
  Bottom 0.61: SLAVE1.16 51.89,214.63
N$57
  Bottom 0.61: P5P6.1 49.71,34.11 SLAVE3.15
N$58
  Bottom 0.406: 49.71,37.01 SLAVE3.16
  Bottom 0.61: P5P6.2 49.71,37.01
N$59
  Bottom 0.61: SLAVE3.25 55.7,59.69 H5H6.1
N$60
  Bottom 0.61: SLAVE3.26 55.7,62.23 H5H6.2
N$61
  Bottom 0.61: SLAVE1.25 54.43,237.49 H1H2.1
N$62
  Bottom 0.61: SLAVE1.26 54.61,240.03 H1H2.2
N$63  (1 unrouted)
  Bottom 0.61: 49.71,176.35 H3H4.1
N$64
  Bottom 0.61: SLAVE2.26 55.7,179.07 H3H4.2
N$65
  Bottom 0.61: LED_S1.A 66.04,241.3 68.58,243.84 P_LED_S1.1
N$66
  Bottom 0.61: LED_M.A 64.77,120.65 67.31,123.19 P_LED_M.1
N$67
  Bottom 0.61: LED_S3.A 68.58,72.39 P_LED_S3.1
N$68
  Bottom 0.61: FRC_S2.4 FRC_S2.6 FRC_S2.8 FRC_S2.10 FRC2_GND.1
N$69
  Bottom 0.61: LED_S2.A 66.04,180.34 68.58,182.88 P_LED_S2.1
N$70
  Bottom 0.61: JP10.2 MASTER.3
N$71
  Bottom 0.61: JP10.3 MASTER.4
N$72
  Bottom 0.61: JP10.4 MASTER.5
N$73
  Bottom 0.61: JP10.5 MASTER.6
N$74
  Bottom 0.61: JP11.1 MASTER.11
N$75
  Bottom 0.61: JP11.2 MASTER.12
N$76
  Bottom 0.61: JP12.1 MASTER.15
N$77
  Bottom 0.61: JP12.2 MASTER.16
N$78
  Bottom 0.61: MASTER.14 41.91,88.9 44.45,86.36 NRF24L01+.4
N$79
  Bottom 0.61: M_PINS1.1 MASTER.23
N$80
  Bottom 0.61: M_PINS1.2 MASTER.24
N$81
  Bottom 0.61: M_PINS1.3 MASTER.25
N$82
  Bottom 0.61: MASTER.26 M_PINS1.4
N$83
  Bottom 0.61: SLAVE3.8 43.18,49.53 45.72,45.72 J1.2
N$84
  Bottom 0.61: SLAVE2.8 43.18,166.37 45.72,163.83 J2.2
N$85
  Bottom 0.61: SLAVE1.8 43.18,227.33 44.45,226.06 J3.2
N$86
  Bottom 0.61: MASTER.8 43.18,107.95 45.72,105.41 J4.2
N$87
  Bottom 0.61: FRC_S1.4 FRC_S1.6 FRC_S1.8 FRC_S1.10 FRC1_GND.1
N$88
  Bottom 0.61: R_S1.2 39.37,250.19 40.64,248.92 SLAVE1.1 38.52,245.11 RESET_S1.1 RESET_S1.2 29.48,242.57 25.4,242.57 21.59,238.76 21.59,214.63 29.21,209.55 43.18,209.55 45.72,207.01 FRC_S1.5
N$89
  Bottom 0.61: FRC_S3.4 FRC_S3.6 FRC_S3.8 FRC_S3.10 FRC3_GND.1
N$90
  Bottom 0.61: FRC_S1.2 55.88,201.93 FRC1_VCC.1
N$91
  Bottom 0.61: FRC_S2.2 54.61,142.24 FRC2_VCC.1
N$92
  Bottom 0.61: FRC_S3.2 53.34,21.59 FRC3_VCC.1
N$93
  Bottom 0.61: R_M1.1 81.28,156.21 | 81.28,156.21 81.28,189.23 80.01,190.5 80.01,248.92 71.12,257.81 R_S5.2 | I2C_1.1 80.01,154.94 81.28,156.21
N$94  (1 unrouted)
  Bottom 0.61: SLAVE2.27 57.15,181.61 R_S6.2 | R_S8.1 81.28,189.23 80.01,190.5
  Bottom 0.813: 80.01,190.5 80.01,189.23
N$95  (1 unrouted)
  Bottom 0.61: R_S9.1 85.09,198.12 | SLAVE2.28 55.88,184.15 R_S7.2
N$96
  Bottom 0.61: SLAVE3.27 55.88,64.77 66.04,74.93 R_S8.2
N$97
  Bottom 0.61: SLAVE3.28 53.34,67.31 62.23,76.2 62.23,81.28 67.31,86.36 R_S9.2
N$98
  Bottom 0.61: MASTER.27 59.69,123.19 R_M1.2
N$99
  Bottom 0.61: MASTER.28 57.79,125.73 67.94,135.89 R_M2.2
VCC
  Bottom 0.61: 5V.3 5V.2 5V.1 5V.3 | 5V.3 5V.4 5V.5 5V.6 5V.7 5V.8 5V.9 5V.10 | POWER_S3.2 59.69,50.8 62.23,53.34 67.31,53.34 69.85,55.88 69.85,49.53 64.77,43.18 64.77,15.24 FRC3_VCC.2 | POWER.1 96.52,38.1 LD33.IN | 73.66,204.47 FRC1_VCC.2 69.85,203.2 55.88,189.23 R_S2.1 | POWER_S1.2 59.69,223.52 60.96,222.25 72.39,222.25 74.93,219.71 | 59.69,162.56 66.04,156.21 68.58,156.21 73.66,151.13 | POWER_M.2 59.69,105.41 63.5,101.6 68.58,101.6 73.66,96.52 53.34,76.2 R_S3.1 | 58.42,130.81 72.39,144.78 73.66,144.78 | I2C_2.1 73.66,163.83 | I2C_1.2 73.66,143.51
  Bottom 0.813: POWER_S2.2 59.69,162.56 | R_M.1 58.42,130.81
  Bottom 1.676: POWER.1 90.17,50.8 5V.1 | R_S1.1 72.39,250.19 74.93,247.65 74.93,219.71 74.93,205.74 73.66,204.47 73.66,163.83 73.66,151.13 FRC2_VCC.2 73.66,144.78 73.66,143.51 73.66,96.52 73.66,59.69 69.85,55.88
  Bottom 1.778: 5V.4 73.66,59.69

### Text on the board
Top: RHex1.0